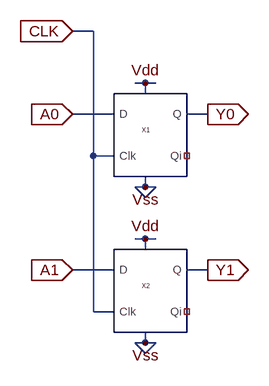
[diagram p0: schematic 2bitreg.asc]
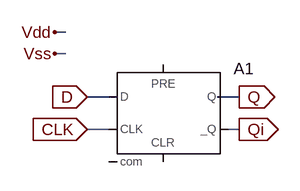
[diagram p1: sub-circuit dff.asc]
2bitreg.asc, the LTspice schematic file:
Version 4
SHEET 1 880 1012
WIRE -192 -224 -224 -224
WIRE -112 -144 -128 -144
WIRE -96 -144 -112 -144
WIRE -112 -128 -112 -144
WIRE -160 -96 -224 -96
WIRE -16 -96 -48 -96
WIRE -192 -32 -192 -224
WIRE -160 -32 -192 -32
WIRE -112 16 -112 0
WIRE -112 16 -128 16
WIRE -96 16 -112 16
WIRE -112 32 -128 16
WIRE -112 32 -96 16
WIRE -112 96 -128 96
WIRE -96 96 -112 96
WIRE -112 112 -112 96
WIRE -160 144 -224 144
WIRE -16 144 -48 144
WIRE -192 208 -192 -32
WIRE -160 208 -192 208
WIRE -112 256 -112 240
WIRE -112 256 -128 256
WIRE -96 256 -112 256
WIRE -112 272 -128 256
WIRE -112 272 -96 256
FLAG -112 -144 Vdd
FLAG -112 16 Vss
FLAG -224 -96 A0
IOPIN -224 -96 In
FLAG -16 -96 Y0
IOPIN -16 -96 Out
FLAG -112 96 Vdd
FLAG -112 256 Vss
FLAG -224 144 A1
IOPIN -224 144 In
FLAG -16 144 Y1
IOPIN -16 144 Out
FLAG -224 -224 CLK
IOPIN -224 -224 In
SYMBOL dff -160 0 R0
SYMATTR InstName X1
SYMBOL dff -160 240 R0
SYMATTR InstName X2

dff.asc, the sub-circuit schematic file:
Version 4
SHEET 1 880 680
WIRE 64 32 48 32
WIRE 64 64 48 64
WIRE 128 128 96 128
WIRE 320 128 288 128
WIRE 128 176 96 176
WIRE 320 176 304 176
FLAG 96 128 D
IOPIN 96 128 In
FLAG 96 176 CLK
IOPIN 96 176 In
FLAG 320 128 Q
IOPIN 320 128 Out
FLAG 320 176 Qi
IOPIN 320 176 Out
FLAG 48 32 Vdd
FLAG 48 64 Vss
SYMBOL Digital\\dflop 208 80 R0
SYMATTR InstName A1
SYMATTR SpiceLine vhigh=5 tau=1n

The netlist it stands for:
* 2bitreg.asc
XX1 A0 CLK Y0 NC_01 Vdd Vss dff
XX2 A1 CLK Y1 NC_02 Vdd Vss dff

* block symbol definitions
.subckt dff D Clk Q Qi VDD Vss
A1 D 0 CLK 0 0 Qi Q 0 DFLOP vhigh=5 tau=1n
.ends dff

.backanno
.end